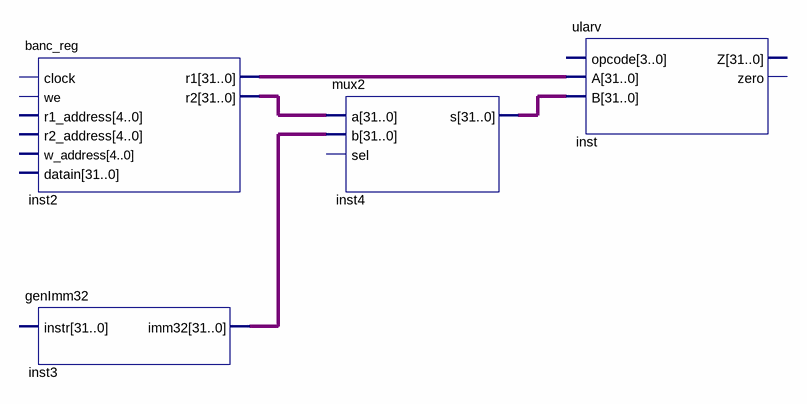
[diagram p0: schematic sheet]
// Quartus schematic Uniciclo.bdf as structural Verilog: 4 symbols, 0 pins
module Uniciclo (
);

  wire [31:0] inst2_r1, inst2_r2, inst3_imm32, inst4_s;

  banc_reg inst2 (.r1(inst2_r1), .r2(inst2_r2));  // open: clock, we, r1_address, r2_address, w_address, datain
  genImm32 inst3 (.imm32(inst3_imm32));  // open: instr
  mux2 inst4 (.a(inst2_r2), .b(inst3_imm32), .s(inst4_s));  // open: sel
  ularv inst (.A(inst2_r1), .B(inst4_s));  // open: opcode, Z, zero
endmodule
